# Altium schematic sheet FPGA.SCHDOC
size B
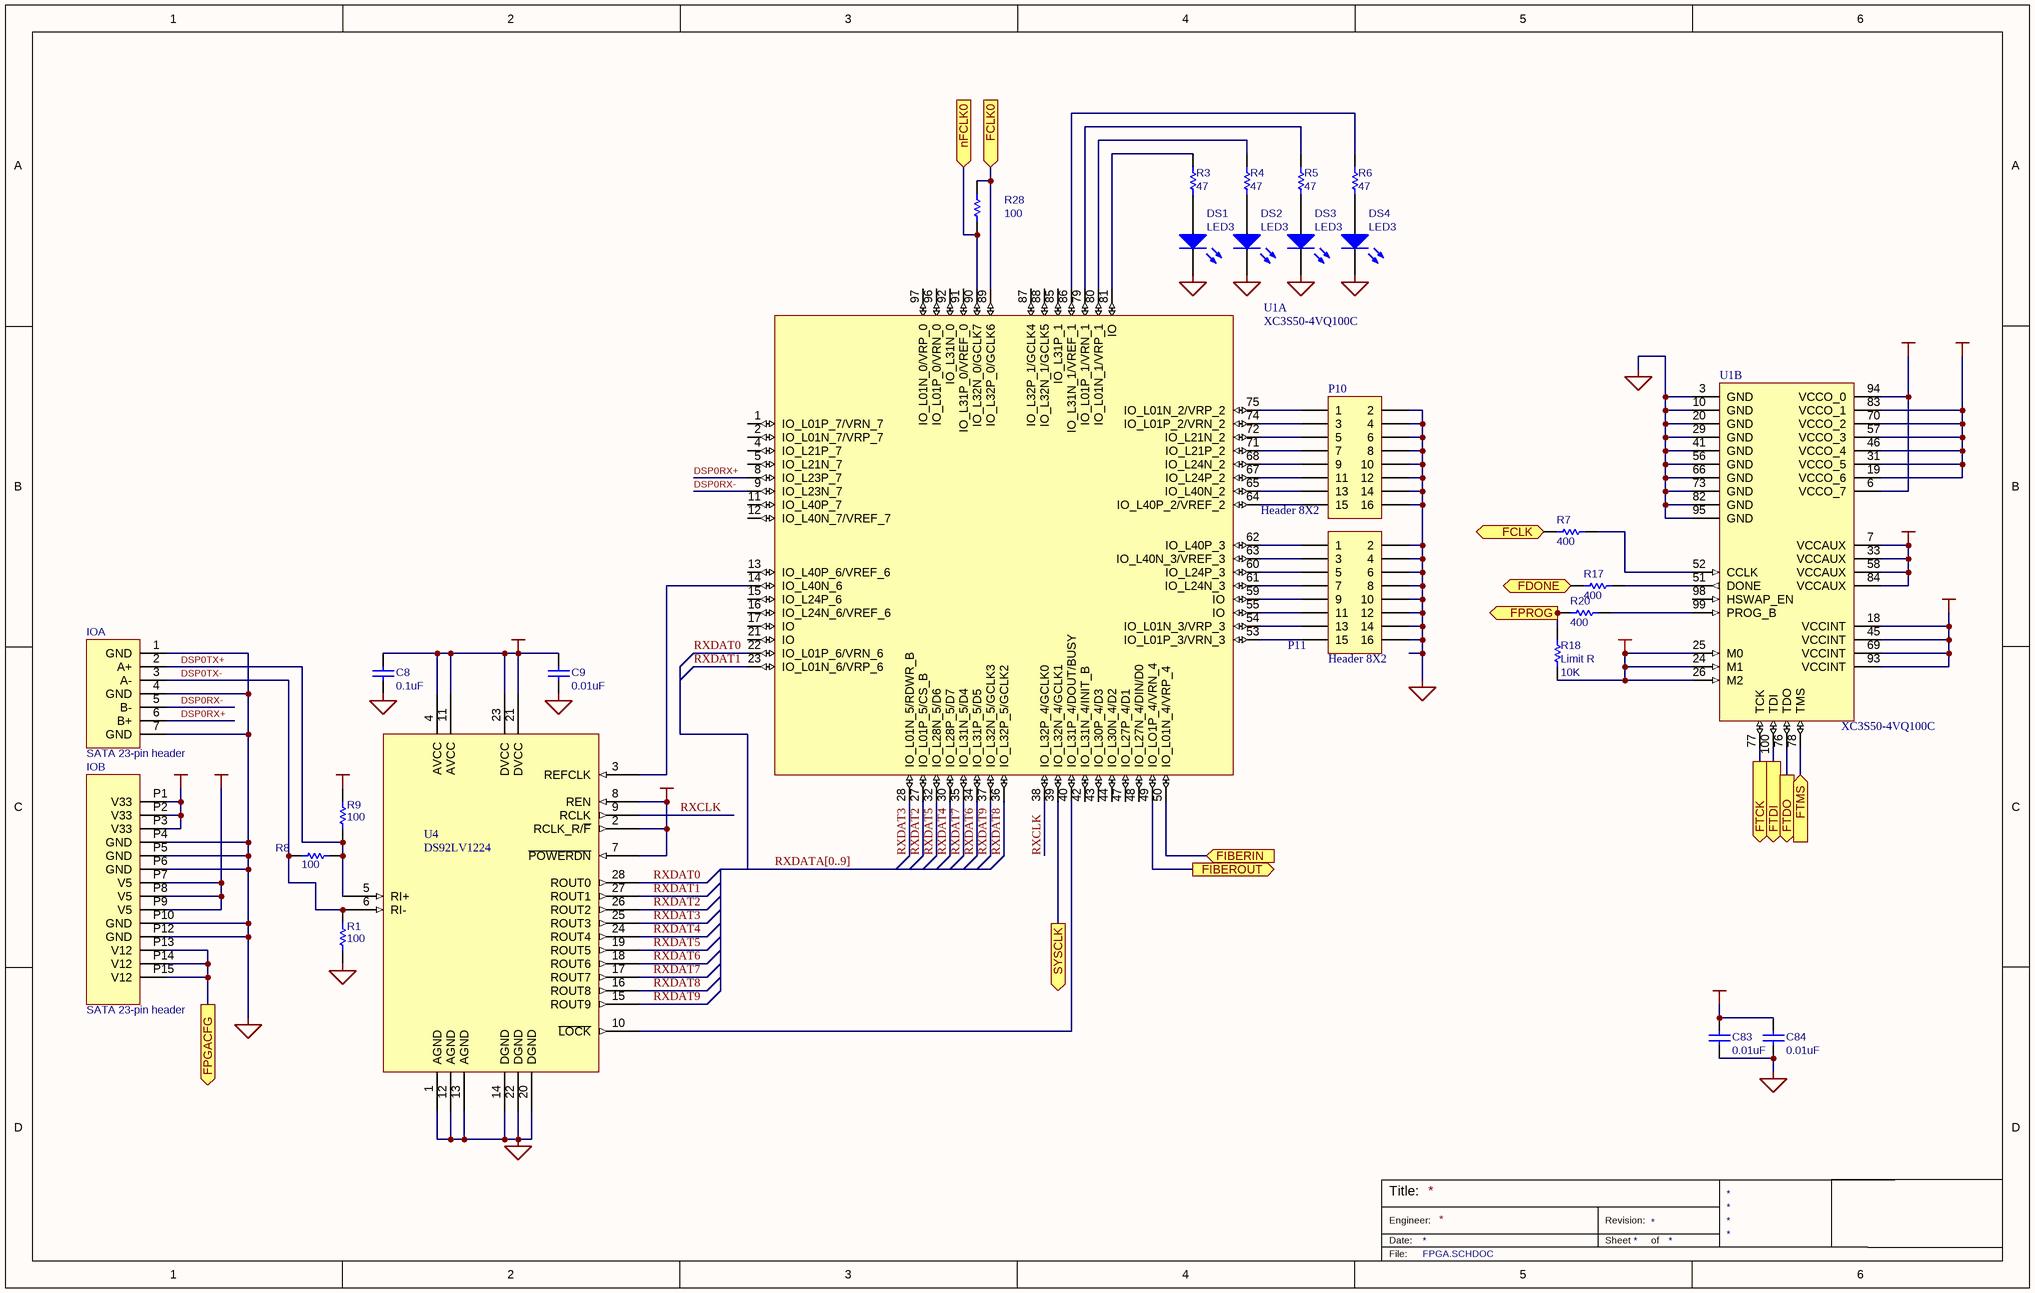
[diagram p0: FPGA.SCHDOC]

## Parts
C8  value 0.1uF  [CC1005-0402]  (hidden comment: Cap)
C9  value 0.01uF  [CC1005-0402]  (hidden comment: Cap)
C83  value 0.01uF  [CC1005-0402]  (hidden comment: Cap)
C84  value 0.01uF  [CC1005-0402]  (hidden comment: Cap)
DS1  LED3  [SMD _LED]
DS2  LED3  [SMD _LED]
DS3  LED3  [SMD _LED]
DS4  LED3  [SMD _LED]
IO  SATA 23-pin header  [MOLEX 87703-0001]  (parts A,B of 2)
P10  Header 8X2  [HDR2X8]
P11  Header 8X2  [HDR2X8]
R1  100  [CR1005-0402]
R3  value 47  [CR1608-0603]  (hidden comment: Res1)
R4  value 47  [CR1608-0603]  (hidden comment: Res1)
R5  value 47  [CR1608-0603]  (hidden comment: Res1)
R6  value 47  [CR1608-0603]  (hidden comment: Res1)
R7  value 400  [CR1608-0603]  (hidden comment: Res1)
R8  100  [CR1005-0402]
R9  100  [CR1005-0402]
R17  value 400  [CR1608-0603]  (hidden comment: Res1)
R18  Limit R  value 10K  [CR1608-0603]
R20  value 400  [CR1608-0603]  (hidden comment: Res1)
R28  100  [CR1005-0402]
U1  XC3S50-4VQ100C  [Xilinx TQ100]  (parts A,B of 2)
U4  DS92LV1224  [SSO-G28/E4.3]

## Ports
FCLK0 (in), FCLK (out), FDONE (out), FIBERIN (in), FIBEROUT (out), FPGACFG (out), FPROG (out), FTCK (out), FTDI (out), FTDO (out), FTMS (in), nFCLK0 (in), SYSCLK (out)

## Nets
+1.2VCC: U1.18(VCCINT) U1.45(VCCINT) U1.69(VCCINT) U1.93(VCCINT)
+2.5VCC: U1.6(VCCO_7) U1.7(VCCAUX) U1.33(VCCAUX) U1.58(VCCAUX) U1.84(VCCAUX) U1.94(VCCO_0)
+5VCC: IO.P7(V5) IO.P8(V5) IO.P9(V5)
GND: C8.1 C9.1 C83.1 C84.1 DS1.2(K) DS2.2(K) DS3.2(K) DS4.2(K) IO.1(GND) IO.4(GND) IO.7(GND) IO.P4(GND) IO.P5(GND) IO.P6(GND) IO.P10(GND) IO.P12(GND) P10.2 P10.4 P10.6 P10.8 P10.10 P10.12 P10.14 P10.16 P11.2 P11.4 P11.6 P11.8 P11.10 P11.12 P11.14 P11.16 R1.1 U1.3(GND) U1.10(GND) U1.20(GND) U1.29(GND) U1.41(GND) U1.56(GND) U1.66(GND) U1.73(GND) U1.82(GND) U1.95(GND) U4.1(AGND) U4.12(AGND) U4.13(AGND) U4.14(DGND) U4.20(DGND) U4.22(DGND)
VCC: C8.2 C9.2 C83.2 C84.2 IO.P1(V33) IO.P2(V33) IO.P3(V33) R9.1 R18.2 U1.19(VCCO_6) U1.24(M1) U1.25(M0) U1.26(M2) U1.31(VCCO_5) U1.46(VCCO_4) U1.57(VCCO_3) U1.70(VCCO_2) U1.83(VCCO_1) U4.2(RCLK_R/~{F}) U4.4(AVCC) U4.7(~{POWERDN}) U4.8(REN) U4.11(AVCC) U4.21(DVCC) U4.23(DVCC)
DSP0RX+: IO.6(B+) U1.8(IO_L23P_7)
DSP0RX-: IO.5(B-) U1.9(IO_L23N_7)
DSP0TX+: IO.2(A+) R8.2 R9.2 U4.5(RI+)
DSP0TX-: IO.3(A-) R1.2 R8.1 U4.6(RI-)
FCLK: R7.2 ; port FCLK
FCLK0: R28.2 U1.89(IO_L32P_0/GCLK6) ; port FCLK0
FDONE: R17.2 ; port FDONE
FIBERIN: U1.50(IO_L01N_4/VRP_4) ; port FIBERIN
FIBEROUT: U1.49(IO_LO1P_4/VRN_4) ; port FIBEROUT
FPGACFG: IO.P13(V12) IO.P14(V12) IO.P15(V12) ; port FPGACFG
FPROG: R18.1 R20.2 ; port FPROG
FTCK: U1.77(TCK) ; port FTCK
FTDI: U1.100(TDI) ; port FTDI
FTDO: U1.76(TDO) ; port FTDO
FTMS: U1.78(TMS) ; port FTMS
nFCLK0: R28.1 U1.90(IO_L32N_0/GCLK7) ; port nFCLK0
RXCLK: U1.38(IO_L32P_4/GCLK0) U4.9(RCLK)
RXDAT0: U1.22(IO_L01P_6/VRN_6) U4.28(ROUT0)
RXDAT1: U1.23(IO_L01N_6/VRP_6) U4.27(ROUT1)
RXDAT2: U1.27(IO_L01P_5/CS_B) U4.26(ROUT2)
RXDAT3: U1.28(IO_L01N_5/RDWR_B) U4.25(ROUT3)
RXDAT4: U1.30(IO_L28P_5/D7) U4.24(ROUT4)
RXDAT5: U1.32(IO_L28N_5/D6) U4.19(ROUT5)
RXDAT6: U1.34(IO_L31P_5/D5) U4.18(ROUT6)
RXDAT7: U1.35(IO_L31N_5/D4) U4.17(ROUT7)
RXDAT8: U1.36(IO_L32P_5/GCLK2) U4.16(ROUT8)
RXDAT9: U1.37(IO_L32N_5/GCLK3) U4.15(ROUT9)
SYSCLK: U1.39(IO_L32N_4/GCLK1) ; port SYSCLK
NetDS1_1: DS1.1(A) R3.2
NetDS2_1: DS2.1(A) R4.2
NetDS3_1: DS3.1(A) R5.2
NetDS4_1: DS4.1(A) R6.2
NetP10_1: P10.1 U1.75(IO_L01N_2/VRP_2)
NetP10_3: P10.3 U1.74(IO_L01P_2/VRN_2)
NetP10_5: P10.5 U1.72(IO_L21N_2)
NetP10_7: P10.7 U1.71(IO_L21P_2)
NetP10_9: P10.9 U1.68(IO_L24N_2)
NetP10_11: P10.11 U1.67(IO_L24P_2)
NetP10_13: P10.13 U1.65(IO_L40N_2)
NetP10_15: P10.15 U1.64(IO_L40P_2/VREF_2)
NetP11_1: P11.1 U1.62(IO_L40P_3)
NetP11_3: P11.3 U1.63(IO_L40N_3/VREF_3)
NetP11_5: P11.5 U1.60(IO_L24P_3)
NetP11_7: P11.7 U1.61(IO_L24N_3)
NetP11_9: P11.9 U1.59(IO)
NetP11_11: P11.11 U1.55(IO)
NetP11_13: P11.13 U1.54(IO_L01N_3/VRP_3)
NetP11_15: P11.15 U1.53(IO_L01P_3/VRN_3)
NetR3_1: R3.1 U1.81(IO)
NetR4_1: R4.1 U1.80(IO_L01N_1/VRP_1)
NetR5_1: R5.1 U1.79(IO_L01P_1/VRN_1)
NetR6_1: R6.1 U1.86(IO_L31N_1/VREF_1)
NetR7_1: R7.1 U1.52(CCLK)
NetR17_1: R17.1 U1.51(DONE)
NetR20_1: R20.1 U1.99(PROG_B)
NetU1_14: U1.14(IO_L40N_6) U4.3(REFCLK)
NetU1_40: U1.40(IO_L31P_4/DOUT/BUSY) U4.10(~{LOCK})

Not connected (* = marked no-connect by the designer): U1 1(IO_L01P_7/VRN_7) 2(IO_L01N_7/VRP_7) 4(IO_L21P_7) 5(IO_L21N_7) 11(IO_L40P_7) 12(IO_L40N_7/VREF_7) 13(IO_L40P_6/VREF_6) 15(IO_L24P_6) 16(IO_L24N_6/VREF_6) 17(IO) 21(IO) 42(IO_L31N_4/INIT_B) 43(IO_L30P_4/D3) 44(IO_L30N_4/D2) 47(IO_L27P_4/D1) 48(IO_L27N_4/DIN/D0) 85(IO_L31P_1) 87(IO_L32P_1/GCLK4) 88(IO_L32N_1/GCLK5) 91(IO_L31P_0/VREF_0) 92(IO_L31N_0) 96(IO_L01P_0/VRN_0) 97(IO_L01N_0/VRP_0) 98(HSWAP_EN)

## Buses and harness runs
bus RXDATA[0..9]

## Notes on the sheet
- Title:
- Engineer:
- Date:
- Revision:
- Sheet
- of
- File:

## Library data of the parts
C8 C9 C83 C84 = Cap: Capacitor; Manufacturer: Generic Components; Class I: Passive; Published: 8-Jun-2000; Revision: July-2002: Re-released for DXP Platform.; Publisher: Altium Limited; Class II: Capacitor
DS1-DS4 = LED3: Typical BLUE SiC LED; Published: 8-Jun-2000; LatestRevisionDate: 17-Dec-2003; LatestRevisionNote: PCB Footprint replaced.; Publisher: Altium Limited
IO = SATA-23
P10 P11 = Header 8X2: Header, 8-Pin, Dual row; LatestRevisionDate: 17-Jul-2002; LatestRevisionNote: Re-released for DXP Platform.; Publisher: Altium Limited
R1 R8 R9 R28 = Res1: Resistor; Manufacturer: Generic Components; Class I: Passive; Value: TERMVALUE; Published: 8-Jun-2000; Revision: July-2002: Re-released for DXP Platform.; Publisher: Altium Limited; Class II: Resistor
R3-R6 R18 = Res1: Resistor; Manufacturer: Generic Components; Class I: Passive; Published: 8-Jun-2000; Revision: July-2002: Re-released for DXP Platform.; Publisher: Altium Limited; Class II: Resistor
R7 R17 R20 = Res1: Resistor; Published: 8-Jun-2000; LatestRevisionDate: 17-Jul-2002; LatestRevisionNote: Re-released for DXP Platform.; Publisher: Altium Limited
U1 = XC3S50-4VQ100C: Xilinx Spartan-3 VQ100; Vendor: Xilinx
U4 = DS92LV1224: 30-66 MHz 10-Bit Bus LVDS Deserializer